# EAGLE design Zaq_HAND_SOLDERING (EAGLE 6.5.0)
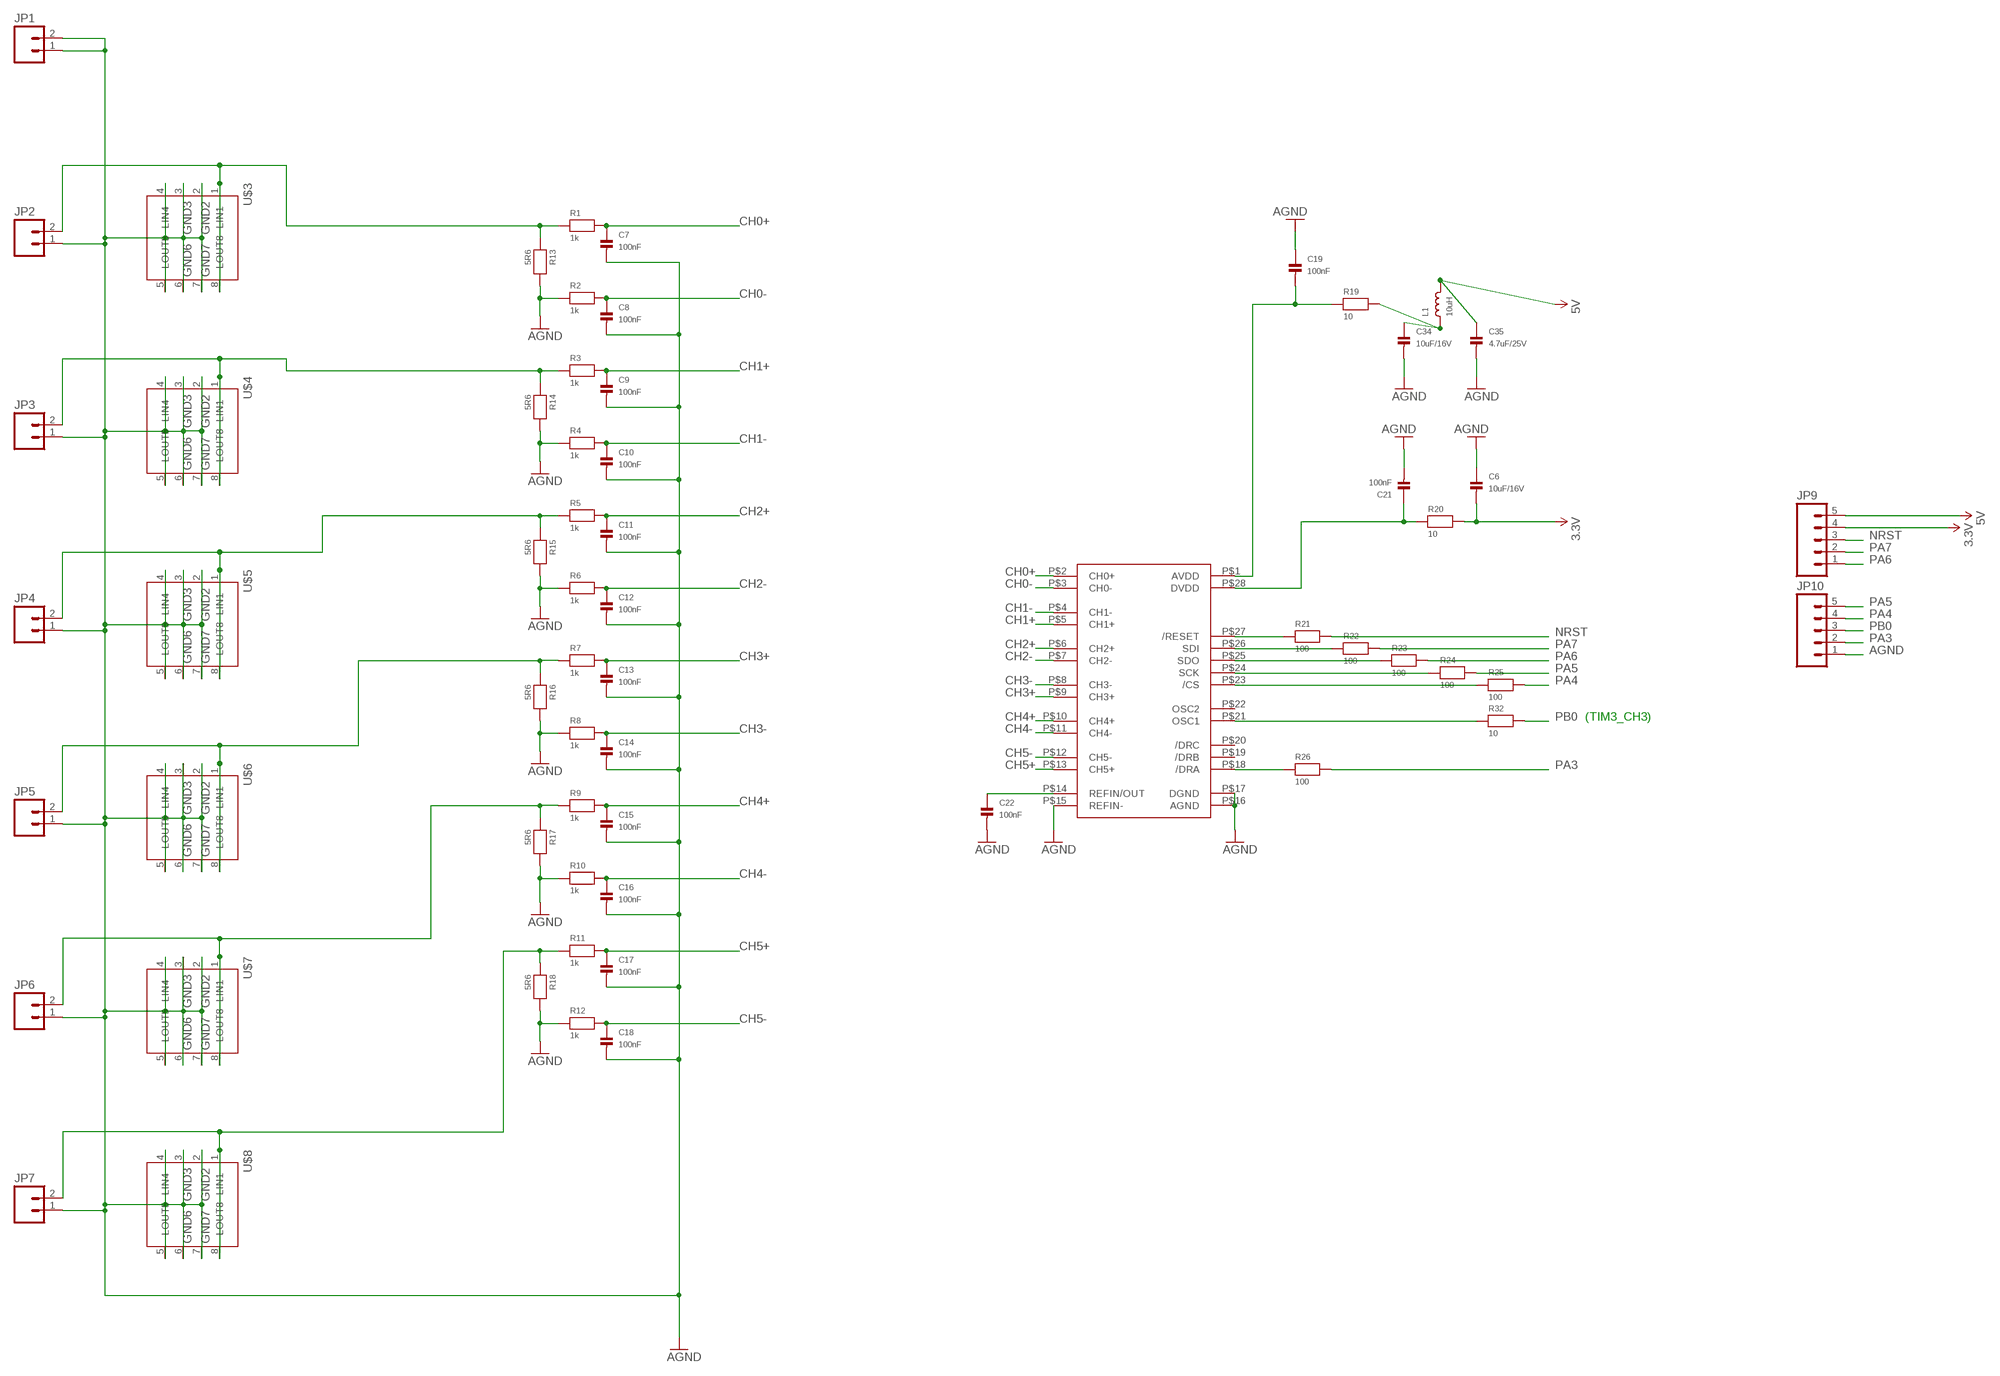
[diagram p0: schematic, sheet 1]

## Parts
.  MCP3903  [SSOP-28]
C6  10uF/16V  CAP_CERAMIC_0805MP  [_0805MP]
C7  100nF  CAP_CERAMIC_0805MP  [_0805MP]
C8  100nF  CAP_CERAMIC_0805MP  [_0805MP]
C9  100nF  CAP_CERAMIC_0805MP  [_0805MP]
C10  100nF  CAP_CERAMIC_0805MP  [_0805MP]
C11  100nF  CAP_CERAMIC_0805MP  [_0805MP]
C12  100nF  CAP_CERAMIC_0805MP  [_0805MP]
C13  100nF  CAP_CERAMIC_0805MP  [_0805MP]
C14  100nF  CAP_CERAMIC_0805MP  [_0805MP]
C15  100nF  CAP_CERAMIC_0805MP  [_0805MP]
C16  100nF  CAP_CERAMIC_0805MP  [_0805MP]
C17  100nF  CAP_CERAMIC_0805MP  [_0805MP]
C18  100nF  CAP_CERAMIC_0805MP  [_0805MP]
C19  100nF  CAP_CERAMIC_0805MP  [_0805MP]
C21  100nF  CAP_CERAMIC_0805MP  [_0805MP]
C22  100nF  CAP_CERAMIC_0805MP  [_0805MP]
C34  10uF/16V  CAP_CERAMIC_0805MP  [_0805MP]
C35  4.7uF/25V  CAP_CERAMIC_0805MP  [_0805MP]
JP1  M025MM  [SCREWTERMINAL-5MM-2]
JP2  M025MM  [SCREWTERMINAL-5MM-2]
JP3  M025MM  [SCREWTERMINAL-5MM-2]
JP4  M025MM  [SCREWTERMINAL-5MM-2]
JP5  M025MM  [SCREWTERMINAL-5MM-2]
JP6  M025MM  [SCREWTERMINAL-5MM-2]
JP7  M025MM  [SCREWTERMINAL-5MM-2]
JP9  M05PTH_LONGPADS  [1X05_LONGPADS]
JP10  M05PTH_LONGPADS  [1X05_LONGPADS]
L1  10uH  INDUCTOR_0805MP  [_0805MP]
R1  1k  RESISTOR_0805MP  [_0805MP]
R2  1k  RESISTOR_0805MP  [_0805MP]
R3  1k  RESISTOR_0805MP  [_0805MP]
R4  1k  RESISTOR_0805MP  [_0805MP]
R5  1k  RESISTOR_0805MP  [_0805MP]
R6  1k  RESISTOR_0805MP  [_0805MP]
R7  1k  RESISTOR_0805MP  [_0805MP]
R8  1k  RESISTOR_0805MP  [_0805MP]
R9  1k  RESISTOR_0805MP  [_0805MP]
R10  1k  RESISTOR_0805MP  [_0805MP]
R11  1k  RESISTOR_0805MP  [_0805MP]
R12  1k  RESISTOR_0805MP  [_0805MP]
R13  5R6  RESISTOR1206  [1206]
R14  5R6  RESISTOR1206  [1206]
R15  5R6  RESISTOR1206  [1206]
R16  5R6  RESISTOR1206  [1206]
R17  5R6  RESISTOR1206  [1206]
R18  5R6  RESISTOR1206  [1206]
R19  10  RESISTOR_0805MP  [_0805MP]
R20  10  RESISTOR_0805MP  [_0805MP]
R21  100  RESISTOR_0805MP  [_0805MP]
R22  100  RESISTOR_0805MP  [_0805MP]
R23  100  RESISTOR_0805MP  [_0805MP]
R24  100  RESISTOR_0805MP  [_0805MP]
R25  100  RESISTOR_0805MP  [_0805MP]
R26  100  RESISTOR_0805MP  [_0805MP]
R32  10  RESISTOR_0805MP  [_0805MP]
U$3  LC03_3V3  [SO8]
U$4  LC03_3V3  [SO8]
U$5  LC03_3V3  [SO8]
U$6  LC03_3V3  [SO8]
U$7  LC03_3V3  [SO8]
U$8  LC03_3V3  [SO8]

## Nets
3.3V: C6.2 JP9.4 R20.2
5V: C35.1 JP9.5 L1.2
AGND: ..P$15(REFIN-) ..P$16(AGND) ..P$17(DGND) C6.1 C7.2 C8.2 C9.2 C10.2 C11.2 C12.2 C13.2 C14.2 C15.2 C16.2 C17.2 C18.2 C19.1 C21.2 C22.2 C34.2 C35.2 JP1.1 JP1.2 JP2.1 JP3.1 JP4.1 JP5.1 JP6.1 JP7.1 JP10.1 R2.1 R4.1 R6.1 R8.1 R10.1 R12.1 R13.2 R14.2 R15.2 R16.2 R17.2 R18.2 U$3.2(GND_2) U$3.3(GND_3) U$3.4(LIN4) U$3.5(LOUT5) U$3.6(GND_6) U$3.7(GND_7) U$4.2(GND_2) U$4.3(GND_3) U$4.4(LIN4) U$4.5(LOUT5) U$4.6(GND_6) U$4.7(GND_7) U$5.2(GND_2) U$5.3(GND_3) U$5.4(LIN4) U$5.5(LOUT5) U$5.6(GND_6) U$5.7(GND_7) U$6.2(GND_2) U$6.3(GND_3) U$6.4(LIN4) U$6.5(LOUT5) U$6.6(GND_6) U$6.7(GND_7) U$7.2(GND_2) U$7.3(GND_3) U$7.4(LIN4) U$7.5(LOUT5) U$7.6(GND_6) U$7.7(GND_7) U$8.2(GND_2) U$8.3(GND_3) U$8.4(LIN4) U$8.5(LOUT5) U$8.6(GND_6) U$8.7(GND_7)
CH0+: ..P$2(CH0+) C7.1 R1.2
CH0-: ..P$3(CH0-) C8.1 R2.2
CH1+: ..P$5(CH1+) C9.1 R3.2
CH1-: ..P$4(CH1-) C10.1 R4.2
CH2+: ..P$6(CH2+) C11.1 R5.2
CH2-: ..P$7(CH2-) C12.1 R6.2
CH3+: ..P$9(CH3+) C13.1 R7.2
CH3-: ..P$8(CH3-) C14.1 R8.2
CH4+: ..P$10(CH4+) C15.1 R9.2
CH4-: ..P$11(CH4-) C16.1 R10.2
CH5+: ..P$13(CH5+) C17.1 R11.2
CH5-: ..P$12(CH5-) C18.1 R12.2
N$3: ..P$21(OSC1) R32.1
N$5: ..P$1(AVDD) C19.2 R19.1
N$8: ..P$14(REFIN/OUT) C22.1
N$9: ..P$28(DVDD) C21.1 R20.1
N$10: ..P$27(/RESET) R21.1
N$11: ..P$26(SDI) R22.1
N$12: ..P$25(SDO) R23.1
N$13: ..P$24(SCK) R24.1
N$14: ..P$23(/CS) R25.1
N$15: ..P$18(/DRA) R26.1
N$28: C34.1 L1.1 R19.2
N$51: JP7.2 R11.1 R18.1 U$8.1(LIN1) U$8.8(LOUT8)
N$53: JP6.2 R9.1 R17.1 U$7.1(LIN1) U$7.8(LOUT8)
N$54: JP5.2 R7.1 R16.1 U$6.1(LIN1) U$6.8(LOUT8)
N$57: JP4.2 R5.1 R15.1 U$5.1(LIN1) U$5.8(LOUT8)
N$58: JP3.2 R3.1 R14.1 U$4.1(LIN1) U$4.8(LOUT8)
N$60: JP2.2 R1.1 R13.1 U$3.1(LIN1) U$3.8(LOUT8)
NRST: JP9.3 R21.2
PA3: JP10.2 R26.2
PA4: JP10.4 R25.2
PA5: JP10.5 R24.2
PA6: JP9.1 R23.2
PA7: JP9.2 R22.2
PB0: JP10.3 R32.2
Unconnected: ..P$19(/DRB) ..P$20(/DRC) ..P$22(OSC2)

## Notes on the sheet
- (TIM3_CH3)

## Library data of the parts
. = ecgparts:MCP3903
C6-C19 C21 C22 C34 C35 = microbuilder:CAP_CERAMIC: Ceramic Capacitors 0402 - 0402 Surface Mount Capacitors 16pF 50V 5% [Digikey: 445-4899-2-ND] 18pF 50V 5% [Digikey: 490-1281-2-ND] 22pF 50V 5% [Digikey: 490-1283-2-ND] 68pF 50V 5% [Digikey: 490-1289-2-ND] 0.1uF 10V 10% [Digikey: 490-1318-2-ND] 1.0uF 6.3V 10% [Digikey: 490-1320-2-ND] 0603 - 0603 Surface Mount Capacitors 16 pF 50V 5% [Digikey: 445-5051-2-ND] 22 pF 50V [Digikey: PCC220ACVTR-ND] 33 pF 50V 5% [Digikey: 490-1415-1-ND] 56pF 50V 5% [Digikey: 490-1421-1-ND] 220pF 50V 5% [Digikey: 445-1285-1-ND] 680 pF 50V 2200 pF 50V 5% C0G [Digikey: 445-1297-1-ND] 5600 pF 100V 5% X7R [Digikey: 478-3711-1-ND] 0.1 µF 25V 10% [Digikey: PCC2277TR-ND] 0.22 µF 16V 10% X7R [Digikey: 445-1318-1-ND] 1.0 µF 25V 10% [Digikey: 445-5146-2-ND] 0603 - RF Specific 3pF 250V +/-0.1pF RF [Digikey: 712-1347-1-ND] 18 pF 250V 5% [Digikey: 478-3505-1-ND or 712-1322-1-ND] 56 pF 250V 5% C0G RF [Digikey: 490-4867-1-ND] 68 pF 250V RF [Digikey: 490-4868-1-ND] 0805 - 0805 Surface Mount Capacitors 220 pF 250V 2% RF Ceramic Capacitor [Digikey: 712-1398-1-ND] 1000 pF 50V 2% NP0 Ceramic Capacitor [Digikey: 478-3760-1-ND] 0.1 µF 25V 10% Ceramic Capacitor [Digikey: PCC1828TR-ND] 1.0 µF 16V 10% Ceramic Capacitor[Digikey: 490-1691-2-ND] 10.0 µF 10V 10% Ceramic Capacitor[Digikey: 709-1228-1-ND] 10.0 uF 16V 10% Ceramic Capacitor [Digikey: 478-5165-2-ND] 47 uF 6.3V 20% Ceramic Capacitor [Digikey: 587-1779-1-ND or 399-5506-1-ND] 1206 - 1206 Surface Mount Capacitors 47uF 10V 20% Ceramic Capacitor [Digikey: 490-5528-1-ND or 399-5508-1-ND or 445-6010-1-ND] 100uF 6.3V -20%, +80% Y5V Ceramic Capacitor (Digikey: 490-4512-1-ND, Mouser: 81-GRM31CF50J107ZE1L)
JP1-JP7 = SparkFun-Connectors:M02: Header 2 Standard 2-pin 0.1" header. Use with straight break away headers (SKU : PRT-00116), right angle break away headers (PRT-00553), swiss pins (PRT-00743), machine pins (PRT-00117), and female headers (PRT-00115). Molex polarized connector foot print use with SKU : PRT-08233 with associated crimp pins and housings.
JP9 JP10 = SparkFun-Connectors:M05: Header 5 Standard 5-pin 0.1" header. Use with straight break away headers (SKU : PRT-00116), right angle break away headers (PRT-00553), swiss pins (PRT-00743), machine pins (PRT-00117), and female headers (PRT-00115). Molex polarized connector foot print use with SKU : PRT-08230 with associated crimp pins and housings.
L1 = microbuilder:INDUCTOR: Inductors 0603: 10nH Ceramic Inductor - microwire antenna/RF (Digikey: 712-1434-2-ND) 0805: 560nH Ceramic Inductor - RF (Digikey: 553-1047-1-ND) 270nH Ceramic Inductor - Q = 40@250MHz, +-5%, 1 Ohm DC Resistance (Digikey: 535-10506-2-ND) 1007 (2518 Metric) SMT: 10µH 10% 250mOhm 820mA 1007 Inductor (Digikey: 587-2189-1-ND) 22µH 10% 500mOhm 580mA 1007 Inductor (Digikey: 587-2190-1-ND) 47µH 10% 950mOhm 420mA 1007 Inductor (Digikey: 587-2191-1-ND) 47µH 5% 100mOhm 1A 1008 Inductor (Digikey: 732-1816-1-ND) 5.0x5.0mm (Taiyo Yuden NR5040 Series) 6.8µH 20% 2.3A 64mOhm Inductor (Digikey: 587-2374-2-ND) 5.0x5.0mm (TDK VLC5045 Series) 4.7µH 20% 3.3A 34mOhm Inductor (Digikey: 445-6526-1-ND) 6.8µH 20% 2.7A 46mOhm Inductor (Digikey: 445-6527-1-ND) 6.0x6.0mm (TDK VLC6045 Series) 4.7µH 20% 3.8A 27mOhm Inductor (Digikey: 445-6538-2-ND) 6.8µH 20% 3A 41mOhm Inductor (Digikey: 445-6540-1-ND) 6.2µH 30% 2.2A 45mOhm Inductor (Digikey: SRR5028-6R2YCT-ND) - Not TDK VLC6045 but footprint should match 6.0x6.0mm (TDK SLF6045 Series) 6.8uH 30% 2A 33mOhm Inductor (Digikey: 445-4572-1-ND, Mouser: 810-SLF645T6R8N2R0PF)
R1-R26 R32 = microbuilder:RESISTOR: Resistors 0402 - 0402 Surface Mount Package 22 Ohm 1% 1/16W [Digikey: 311-22.0LRTR-ND] 33 Ohm 5% 1/16W 1.0K 5% 1/16W 1.5K 5% 1/16W 2.0K 1% 1/16W 10.0K 1% 1/16W [Digikey: 311-10.0KLRTR-ND] 10.0K 5% 1/16W [Digikey: RMCF0402JT10K0TR-ND] 12.1K 1% 1/16W [Digikey: 311-22.0LRTR-ND] 100.0K 5% 1/16W 0603 - 0603 Surface Mount Package 0 Ohm 1/10 Watt 1% Resistor 15 Ohm 1/10 Watt 1% Resistor 33 Ohm 1/10 Watt 1% Resistor 49.9 Ohm 1/10 Watt 1% Resistor 100 Ohm 1/10 Watt 1% Resistor 150 Ohm 1/10 Watt 1% Resistor 240 Ohm 1/10 Watt 1% Resistor 390 Ohm 1/10 Watt 1% Resistor 560 Ohm 1/10 Watt 1% Resistor 680 Ohm 1/10 Watt 1% Resistor 750 Ohm 1/10 Watt 1% Resistor 1.0K Ohm 1/10 Watt 1% Resistor 1.5K Ohm 1/10 Watt 1% Resistor 2.0K Ohm 1/10 Watt 1% Resistor 2.2K Ohm 1/10 Watt 1% Resistor 3.3K Ohm 1/10 Watt 1% Resistor 4.7K Ohm 1/10 Watt 1% Resistor 10.0K Ohm 1/10 Watt 1% Resistor 12.0K Ohm 1/10 Watt 1% Resistor 12.1K Ohm 1/10 Watt 1% Resistor 20.0K Ohm 1/10 Watt 1% Resistor 33.0K Ohm 1/10 Watt 1% Resistor 100.0K Ohm 1/10 Watt 1% Resistor 0805 - 0805 Surface Mount Package 0 Ohm 1/8 Watt 1% Resistor 33 Ohm 1/8 Watt 1% Resistor 100 Ohm 1/8 Watt 1% Resistor 150 Ohm 1/8 Watt 1% Resistor 200 Ohm 1/8 Watt 1% Resistor 240 Ohm 1/8 Watt 1% Resistor 330 Ohm 1/8 Watt 1% Resistor 390 Ohm 1/8 Watt 1% Resistor 470 Ohm 1/8 Watt 1% Resistor 1.0K Ohm 1/8 Watt 1% Resistor 1.5K Ohm 1/8 Watt 1% Resistor 2.0K Ohm 1/8 Watt 1% Resistor 4.7K Ohm 1/8 Watt 1% Resistor 5.1K Ohm 1/8 Watt 1% Resistor 5.6K Ohm 1/8 Watt 1% Resistor 10.0K Ohm 1/8 Watt 1% Resistor 22.0K Ohm 1/8 Watt 1% Resistor 33.0K Ohm 1/8 Watt 1% Resistor 100K Ohm 1/8 Watt 1% Resistor 1206 - 1206 Surface Mount Package 2012 - 2010 Surface Mount Package 0.11 Ohm 1/2 Watt 1% Resistor - Digikey: RHM.11UCT-ND
U$3-U$8 = LC03_3v3:LC03_3V3

## Board
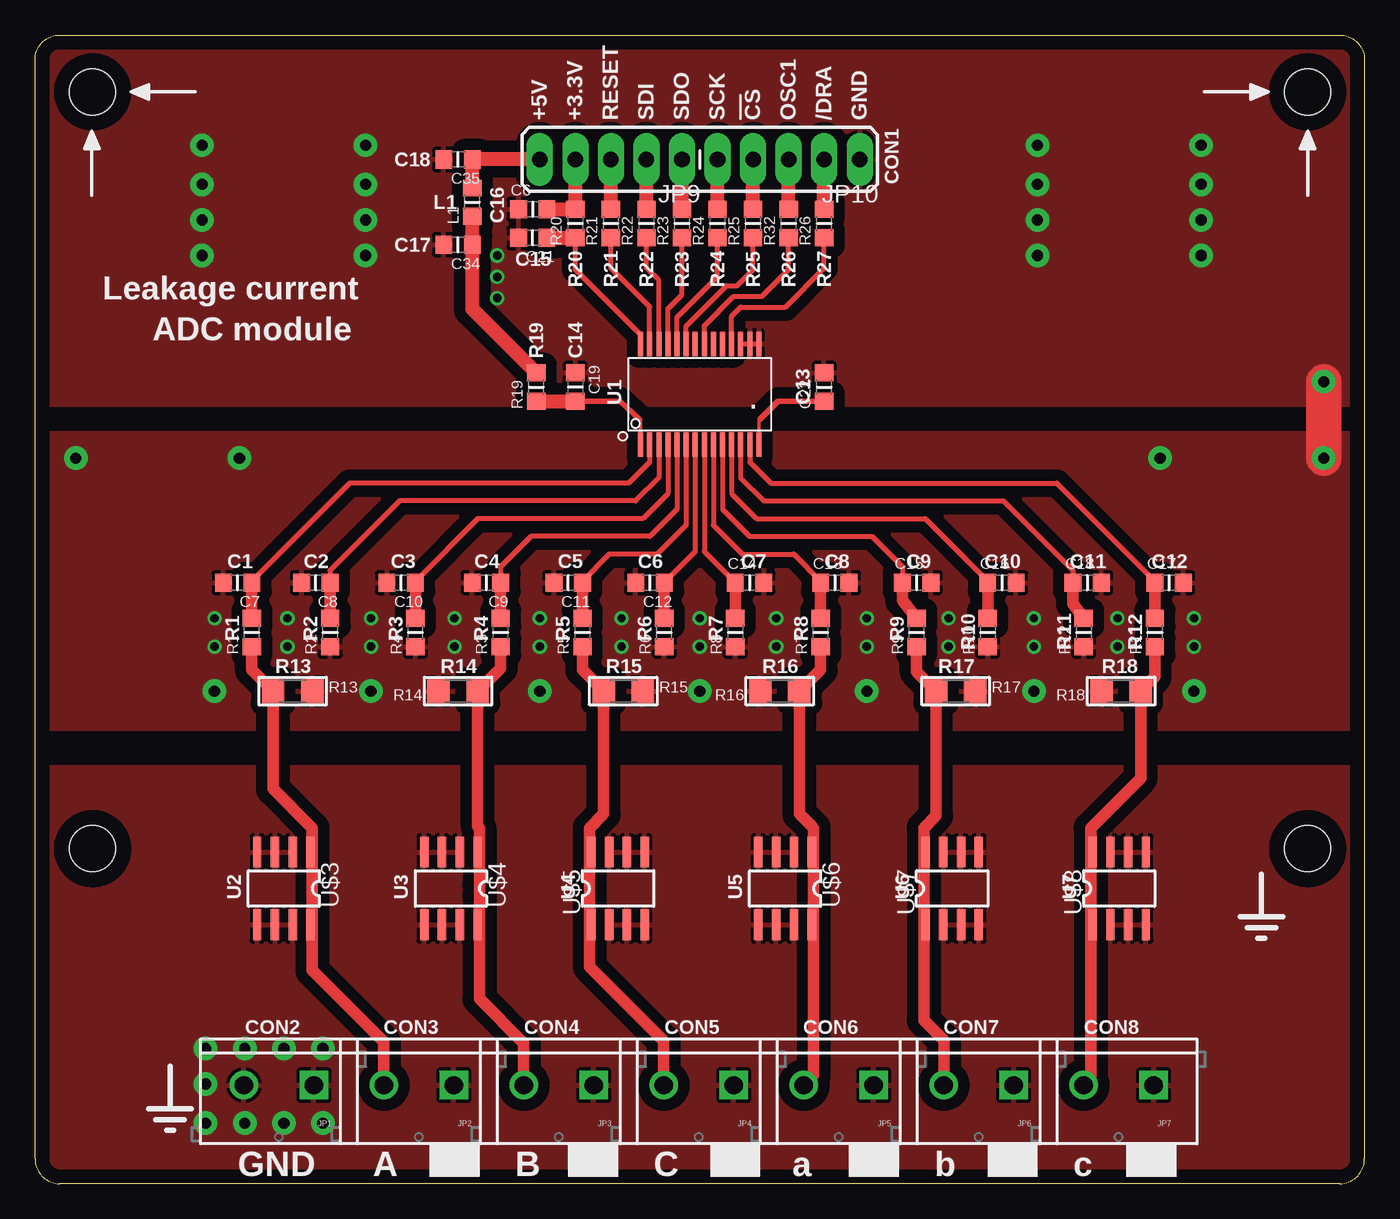
[diagram p1: board, top side]
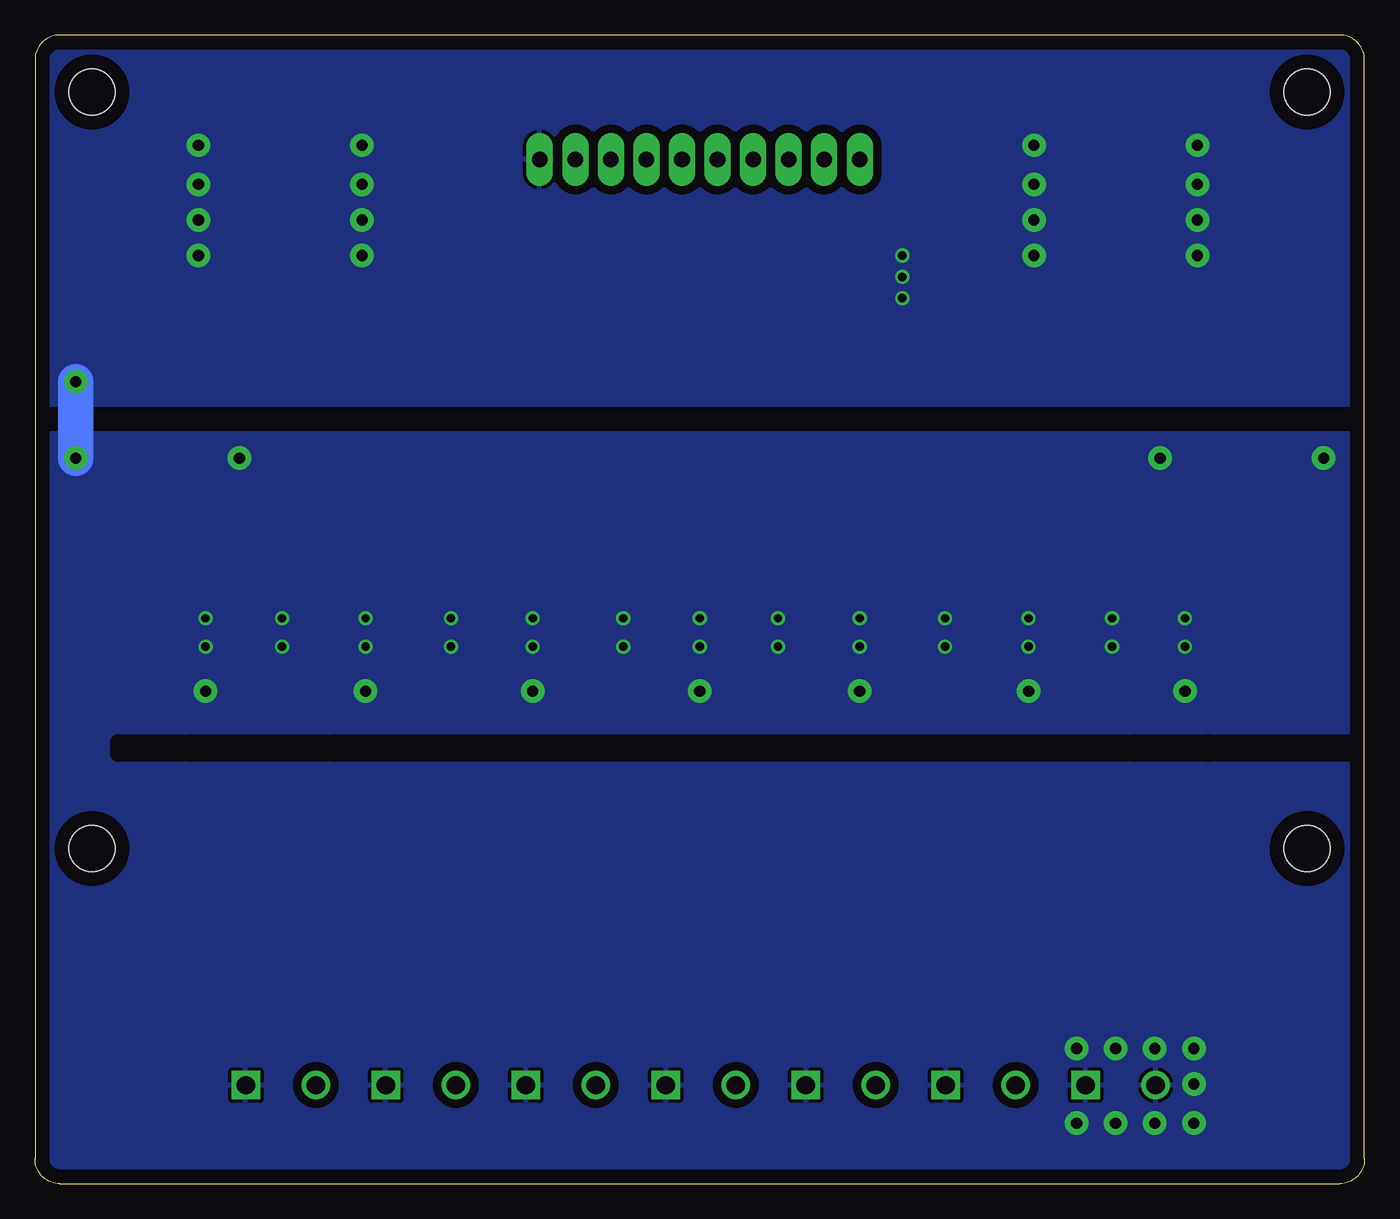
[diagram p2: board, bottom side, seen from below]

Size 95 x 82.04 mm. Coordinates in mm from the lower left corner, seen from the top.
Outline: 0,1.78 0,80.26 arc-90 1.78,82.04 93.22,82.04 arc-90 95,80.26 95,1.78 arc-90 93.22,0 1.78,0 arc-90 0,1.78
Copper layers (1*16): Top 0.035mm / dielectric 1.5mm / Bottom 0.035mm
Design rules "default *": minimum track width 10mil, minimum drill 24mil, track to track 8mil, track to pad 8mil, pad to pad 8mil, via to via 8mil, smd to smd 8mil, copper to edge 40mil, drill to drill 8mil, minimum pad ring 10mil, minimum via ring 8mil, stop-mask expansion 4mil, vias tented up to drill 0mil, thermal gap 10mil
tRestrict: area 11.2,30.7 to 83.8,31.5; area 1,30.7 to 73.7,31.5; area 16.4,30.7 to 89,31.5; area 22.2,30.7 to 94.9,31.5
bRestrict: area 11.2,30.7 to 83.8,31.5; area 1,30.7 to 73.7,31.5; area 16.4,30.7 to 89,31.5

### Footprints (pad centres in the part's own frame; a part is rotated, then mirrored left to right if it is on the bottom)
SSOP-28 = smd 1.75 x 0.356: P$1 -3.6,4.225; P$2 -3.6,3.575; P$3 -3.6,2.925; P$4 -3.6,2.275; P$5 -3.6,1.625; P$6 -3.6,0.975; P$7 -3.6,0.325; P$8 -3.6,-0.325; P$9 -3.6,-0.975; P$10 -3.6,-1.625; P$11 -3.6,-2.275; P$12 -3.6,-2.925; P$13 -3.6,-3.575; P$14 -3.6,-4.225; P$15 3.6,-4.225; P$16 3.6,-3.575; P$17 3.6,-2.925; P$18 3.6,-2.275; P$19 3.6,-1.625; P$20 3.6,-0.975; P$21 3.6,-0.325; P$22 3.6,0.325; P$23 3.6,0.975; P$24 3.6,1.625; P$25 3.6,2.275; P$26 3.6,2.925; P$27 3.6,3.575; P$28 3.6,4.225
_0805MP = smd 1.2 x 1.3: 1 -1.016,0; 2 1.016,0
SCREWTERMINAL-5MM-2 = drill 1.3 pad 2.032 square: 1 0,0 | drill 1.3 pad 2.032: 2 5,0
1X05_LONGPADS = drill 1.118 pad 1.88 long: 1 0,0; 2 2.54,0; 3 5.08,0; 4 7.62,0; 5 10.16,0
1206 = smd 1.6 x 1.8: 1 -1.4,0; 2 1.4,0
STAND-OFF = hole 3.302: 0,0
SO8 = smd 0.6 x 2.2: 1 -1.905,-2.6; 2 -0.635,-2.6; 3 0.635,-2.6; 4 1.905,-2.6; 5 1.905,2.6; 6 0.635,2.6; 7 -0.635,2.6; 8 -1.905,2.6

### Placement (x,y rotation side)
.  47.5,56.39 90 top
C6  35.56,69.6 0 top
C7  14.48,42.93 180 top
C8  20.07,42.93 180 top
C9  32.26,42.93 180 top
C10  26.16,42.93 180 top
C11  38.1,42.93 180 top
C12  43.94,42.93 180 top
C13  57.15,42.93 0 top
C14  51.05,42.93 0 top
C15  62.99,42.93 0 top
C16  69.09,42.93 0 top
C17  81.03,42.93 0 top
C18  75.18,42.93 0 top
C19  38.61,56.9 270 top
C21  35.56,67.56 180 top
C22  56.39,56.9 90 top
C34  30.23,67.06 180 top
C35  30.23,73.15 180 top
JP1  19.93,7.03 180 top
JP2  29.93,7.03 180 top
JP3  39.93,7.03 180 top
JP4  49.93,7.03 180 top
JP5  59.93,7.03 180 top
JP6  69.93,7.03 180 top
JP7  79.93,7.03 180 top
JP9  46.23,73.15 180 top
JP10  58.93,73.15 180 top
L1  31.24,70.1 90 top
R1  15.49,39.37 90 top
R2  21.08,39.37 90 top
R3  33.27,39.37 90 top
R4  27.18,39.37 90 top
R5  39.12,39.37 90 top
R6  44.96,39.37 90 top
R7  56.13,39.37 90 top
R8  50.04,39.37 90 top
R9  62.99,39.37 90 top
R10  68.07,39.37 90 top
R11  80.01,39.37 90 top
R12  74.93,39.37 90 top
R13  18.41,35.18 0 top
R14  30.23,35.18 180 top
R15  42.04,35.18 0 top
R16  53.21,35.18 180 top
R17  65.79,35.18 0 top
R18  77.6,35.18 180 top
R19  35.81,56.9 90 top
R20  38.61,68.58 90 top
R21  41.15,68.58 90 top
R22  43.69,68.58 90 top
R23  46.23,68.58 90 top
R24  48.77,68.58 90 top
R25  51.31,68.58 90 top
R26  56.39,68.58 90 top
R32  53.85,68.58 90 top
STANDOFF1  STAND-OFF  [STAND-OFF]  90.93,23.93 0 top
STANDOFF6  STAND-OFF  [STAND-OFF]  4.11,77.98 0 top
STANDOFF10  STAND-OFF  [STAND-OFF]  90.93,77.98 0 top
STANDOFF12  STAND-OFF  [STAND-OFF]  4.11,23.93 0 top
U$3  17.78,21.08 180 top
U$4  29.72,21.08 180 top
U$5  41.66,21.08 0 top
U$6  53.59,21.08 180 top
U$7  65.53,21.08 0 top
U$8  77.47,21.08 0 top

### Tracks (layer width: path | path; a pad name or v marks a point on that pad's centre or on a via)
3.3V
  Top 1.016: JP9.4 R20.2 C6.2
5V
  Top 1.016: JP9.5 C35.1 L1.2
AGND  (via drill 0.6, 0.8 pad 1.68)
  Top 0.356: ..P$17 ..P$16 ..P$15
  Top 2.54: v92.08,57.28 v92.08,51.82
  Bottom 2.54: v92.08,51.82 v92.08,57.28
  other vias: 24,35.18 36.07,35.18 47.5,35.18 59.44,35.18 71.37,35.18 82.8,35.18 11.94,74.17 23.62,74.17 83.31,74.17 71.63,74.17 33.02,66.29 33.02,64.77 33.02,63.25 2.92,51.82 14.61,51.82 80.39,51.82 18.03,40.39 24,40.39 29.97,40.39 36.07,40.39 41.91,40.39 47.5,40.39 52.96,40.39 59.44,40.39 65.28,40.39 71.37,40.39 77.34,40.39 82.8,40.39 12.83,40.39 12.83,38.35 18.03,38.35 24,38.35 29.97,38.35 36.07,38.35 41.91,38.35 47.5,38.35 52.96,38.35 59.44,38.35 65.28,38.35 71.37,38.35 77.34,38.35 82.8,38.35 12.83,35.18 83.31,71.37 83.31,68.83 83.31,66.29 71.63,71.37 71.63,68.83 71.63,66.29 23.62,71.37 23.62,68.83 23.62,66.29 11.94,71.37 11.94,68.83 11.94,66.29 14.99,9.65 12.19,9.65 12.19,4.32 12.19,7.11 14.99,4.32 17.78,9.65 17.78,4.32 20.57,4.32 20.57,9.65
  pour Top (isolate 0.813): 95,55.63 0,55.63 0,82.04 95,82.04
  pour Bottom (isolate 0.61): 0,55.63 95,55.63 95,82.04 0,82.04
  pour Top (isolate 0.813): 95,0 0,0 0,53.59 95,53.59
  pour Bottom (isolate 0.61): 0,0 95,0 95,53.59 0,53.59
CH0+
  Top 0.356: ..P$2 43.92,51.54 42.42,50.04 22.49,50.04 15.49,43.04 C7.1
  Top 0.813: C7.1 R1.2
CH0-
  Top 0.356: ..P$3 44.57,50.41 42.93,48.77 26.05,48.77 21.08,43.8 C8.1
  Top 0.813: C8.1 R2.2
CH1+
  Top 0.356: ..P$5 45.87,48.16 43.94,46.23 35.44,46.23 33.27,44.06 C9.1
  Top 0.813: C9.1 R3.2
CH1-
  Top 0.356: ..P$4 45.22,49.29 43.43,47.5 31.63,47.5 27.18,43.04 C10.1
  Top 0.813: C10.1 R4.2
CH2+
  Top 0.356: ..P$6 46.52,47.03 44.45,44.96 41.03,44.96 39.12,43.04 C11.1
  Top 0.813: C11.1 R5.2
CH2-
  Top 0.356: ..P$7 47.17,45.14 C12.1
  Top 0.813: C12.1 R6.2
CH3+
  Top 0.356: ..P$9 48.47,47.03 50.55,44.96 54.22,44.96 56.13,43.04 C13.1
  Top 0.813: C13.1 R7.2
CH3-
  Top 0.356: ..P$8 47.82,45.14 C14.1
  Top 0.813: C14.1 R8.2
CH4+
  Top 0.356: ..P$10 49.12,48.16 51.05,46.23 59.81,46.23 61.98,44.06 C15.1
  Top 0.813: C15.1 61.98,41.66 R9.2
CH4-
  Top 0.356: ..P$11 49.77,49.29 51.56,47.5 63.62,47.5 68.07,43.04 C16.1
  Top 0.813: C16.1 R10.2
CH5+
  Top 0.356: ..P$13 51.07,51.54 52.58,50.04 73.01,50.04 80.01,43.04 C17.1
  Top 0.813: C17.1 R11.2
CH5-
  Top 0.356: ..P$12 50.42,50.41 52.07,48.77 69.2,48.77 74.17,43.8 C18.1
  Top 0.813: C18.1 74.17,41.4 R12.2
N$3
  Top 0.356: ..P$21 47.82,61.28 49.91,63.37 51.94,63.37 53.85,65.28 R32.1
N$5
  Top 0.254: 43.18,54.61 43.27,54.52 ..P$1
  Top 0.406: C19.2 41.79,55.87 43.18,54.61
  Top 1.016: R19.1 C19.2
N$8
  Top 0.254: ..P$14 51.72,54.52 51.82,54.61
  Top 0.406: 51.82,54.61 53.08,55.87 C22.1
N$9
  Top 0.254: 43.23,60.66 43.27,60.61 ..P$28
  Top 0.356: 43.23,60.66 38.61,65.28 R20.1
  Top 1.016: C21.1 R20.1
N$10
  Top 0.356: ..P$27 43.92,62.62 41.15,65.39 R21.1
N$11
  Top 0.356: ..P$26 44.57,64.51 43.69,65.39 R22.1
N$12
  Top 0.356: ..P$25 45.22,62.49 46.23,63.5 R23.1
N$13
  Top 0.356: ..P$24 45.87,61.88 48.77,64.77 R24.1
N$14
  Top 0.356: ..P$23 46.52,61.26 49.4,64.14 50.16,64.14 51.31,65.28 R25.1
N$15
  Top 0.356: ..P$18 49.77,61.97 50.42,62.61 53.6,62.61 56.39,65.39 R26.1
N$28
  Top 1.016: L1.1 C34.1 31.24,62.48 R19.2
N$51
  Top 0.254: 75.44,25.4 U$8.8 U$8.1
  Top 0.813: JP7.2 75.44,7.54 75.44,25.4 79,28.96 R18.1 80.01,36.19 R11.1
N$53
  Top 0.254: U$7.8 63.63,21.21 63.5,21.08 | U$7.1 63.63,20.45 63.5,20.57
  Top 0.813: JP6.2 64.93,10.26 63.5,11.68 63.5,20.57 63.5,21.08 63.5,25.4 64.39,26.29 R17.1 62.99,36.57 R9.1
N$54
  Top 0.254: 55.63,25.4 55.5,25.53 U$6.1 U$6.8
  Top 0.813: 55.63,25.4 55.63,7.73 JP5.2 | R7.1 56.13,36.7 R16.1 54.61,26.41 55.5,25.53
N$57
  Top 0.254: U$5.8 39.75,20.7 | 39.75,20.7 39.62,20.57 | U$5.1 39.75,20.7 | 39.75,20.7 39.62,20.83
  Top 0.813: JP4.2 44.93,10.19 39.62,15.49 39.62,20.57 39.62,20.83 39.62,25.4 40.64,26.41 R15.1 39.12,36.7 R5.1
N$58
  Top 0.254: U$4.1 31.62,21.46 31.75,21.34 | U$4.8 31.62,20.45 31.75,20.57
  Top 0.813: JP3.2 34.93,10.03 31.75,13.21 31.75,20.57 31.75,21.34 31.75,25.4 31.63,25.52 R14.1 33.27,36.83 R3.1
N$60
  Top 0.254: U$3.1 U$3.8 19.68,16.89 19.81,16.76
  Top 0.813: JP2.2 24.93,10.13 19.81,15.24 19.81,16.76 19.81,25.4 17.02,28.2 R13.1 15.49,36.7 R1.1
NRST
  Top 1.016: R21.2 JP9.3
PA3
  Top 1.016: R26.2 JP10.2
PA4
  Top 1.016: R25.2 JP10.4
PA5
  Top 1.016: R24.2 JP10.5
PA6
  Top 1.016: R23.2 JP9.1
PA7
  Top 1.016: R22.2 JP9.2
PB0
  Top 1.016: R32.2 JP10.3

### Text on the board
tPlace: +5V | +3.3V | RESET | SDI | SDO | SCK | CS | OSC1 | /DRA | GND | C18 | CON1 | L1 | C16 | C17 | C15 | R20 | R21 | R22 | R23 | R24 | R25 | R26 | R27 | Leakage current | ADC module | R19 | C14 | U1 | C13 | C1 | C2 | C3 | C4 | C5 | C6 | C7 | C8 | C9 | C10 | C11 | C12 | R1 | R2 | R3 | R4 | R5 | R6 | R7 | R8 | R9 | R10 | R11 | R12 | R13 | R14 | R15 | R16 | R17 | R18 | U2 | U3 | U4 | U5 | U6 | U7 | CON2 | CON3 | CON4 | CON5 | CON6 | CON7 | CON8 | GND | A | B | C | a | b | c